# Altium schematic sheet B802 PCIe Socket.SchDoc: B802AA PCIe Socket
size 292 x 193 mm; SheetNumber: 18; SheetTotal: 18
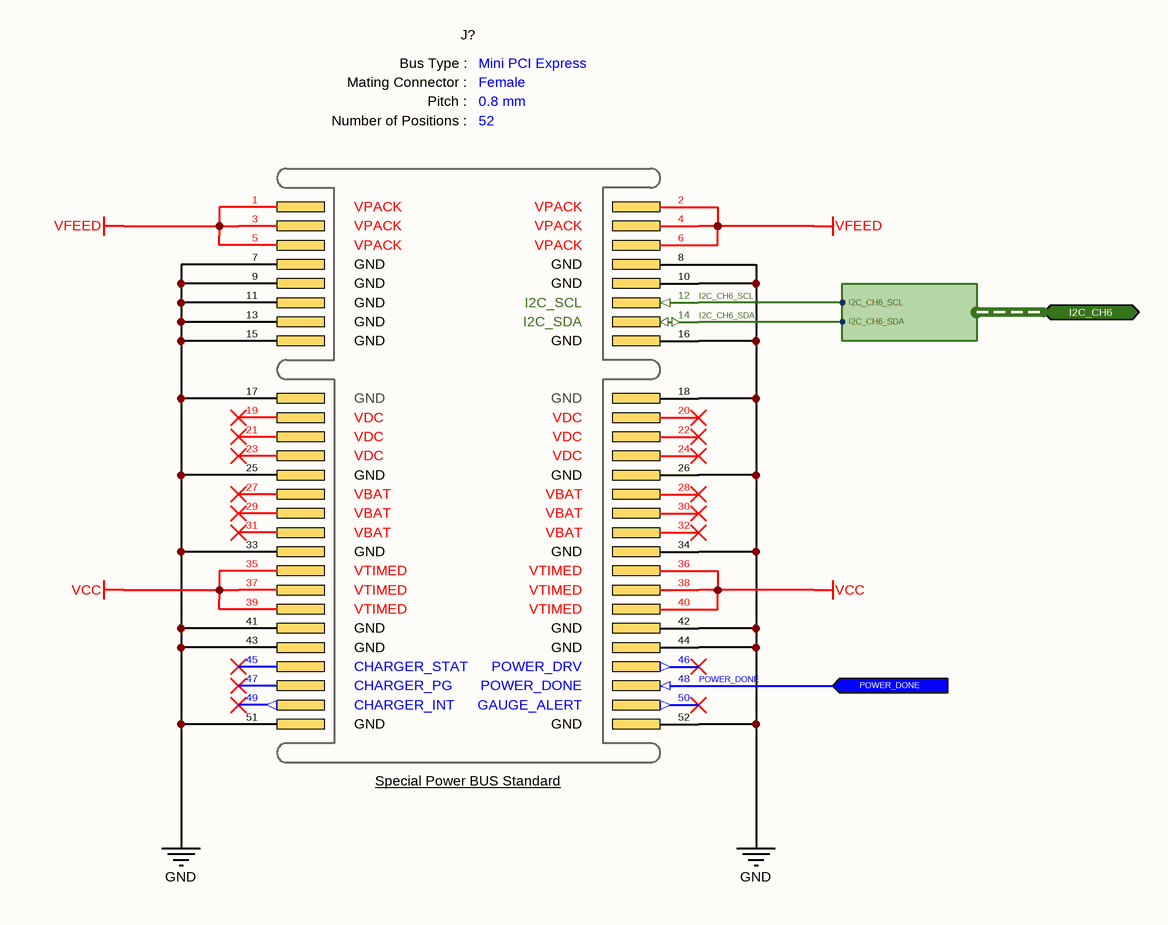
[diagram p0: B802 PCIe Socket.SchDoc]

## Parts
J?  BUS Type: Mini PCI Express  Connector Type: Female  Pitch: 0.8 mm  Number of Positions: 52  [CONNECTOR - Mini PCIe (Light)]  (hidden comment: TE-1775862-2)

## Ports
I2C_CH6 (bidir, harness I2C_CH6), POWER_DONE (in)

## Harnesses
I2C_CH6: I2C_CH6_SCL, I2C_CH6_SDA

## Nets
GND: J?.7(Pin-7) J?.8(Pin-8) J?.9(Pin-9) J?.10(Pin-10) J?.11(Pin-11) J?.13(Pin-13) J?.15(Pin-15) J?.16(Pin-16) J?.17(Pin-17) J?.18(Pin-18) J?.25(Pin-25) J?.26(Pin-26) J?.33(Pin-33) J?.34(Pin-34) J?.41(Pin-41) J?.42(Pin-42) J?.43(Pin-43) J?.44(Pin-44) J?.51(Pin-51) J?.52(Pin-52)
VCC: J?.35(Pin-35) J?.36(Pin-36) J?.37(Pin-37) J?.38(Pin-38) J?.39(Pin-39) J?.40(Pin-40)
VFEED: J?.1(Pin-1) J?.2(Pin-2) J?.3(Pin-3) J?.4(Pin-4) J?.5(Pin-5) J?.6(Pin-6)
I2C_CH6_SCL: J?.12(Pin-12) ; port I2C_CH6.I2C_CH6_SCL
I2C_CH6_SDA: J?.14(Pin-14) ; port I2C_CH6.I2C_CH6_SDA
POWER_DONE: J?.48(Pin-48) ; port POWER_DONE

Not connected (* = marked no-connect by the designer): J? 19(Pin-19)* 20(Pin-20)* 21(Pin-21)* 22(Pin-22)* 23(Pin-23)* 24(Pin-24)* 27(Pin-27)* 28(Pin-28)* 29(Pin-29)* 30(Pin-30)* 31(Pin-31)* 32(Pin-32)* 45(Pin-45)* 46(Pin-46)* 47(Pin-47)* 49(Pin-49)* 50(Pin-50)*

## Notes on the sheet
- © 2021 All rights reserved.
  This document may not, in whole or in part, be copied, photocopied, reproduced, translated or converted to any electronic or machine readable from without prior written permission of Mehmet Günce Akkoyun.
  Engineer contact : akkoyun@me.com
- Property of
- Engineer :
- Date :
- Size :
- A4
- Time :
- Project :
- Page :
- /
- Customer :
- Product ID :
- Module ID :
- Version :
- File :
- Revision :
- (in symbol Connector - Mini PCI-E (Female B802)) Bus Type :; Mating Connector :; Pitch :; Number of Positions :; VPACK; GND; I2C_SCL; I2C_SDA; VDC; VBAT; VTIMED; CHARGER_STAT; POWER_DRV; CHARGER_PG; POWER_DONE; CHARGER_INT; GAUGE_ALERT; Special Power BUS Standard

## Library data of the parts
J? = Connector - Mini PCI-E (Female B802): Mini PCI-Express female connector.; Manufacturer Name: TE Connectivity; Manufacturer Part Number: TE-1775862-2; System: Connector